# Altium schematic sheet POWER.SchDoc
size A4
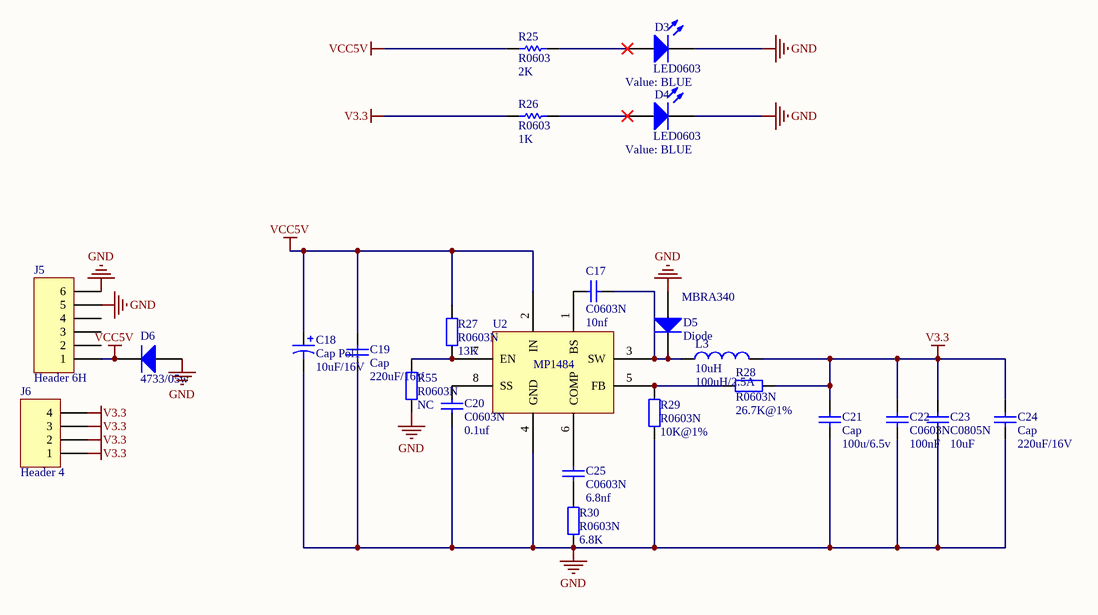
[diagram p0: POWER.SchDoc]

## Parts
C17  C0603N  value 10nf  [R0603N]
C18  Cap Pol1  value 10uF/16V  [C1206-A]
C19  Cap  value 220uF/16V  [16V220U-tie]
C20  C0603N  value 0.1uf  [R0603N]
C21  Cap  value 100u/6.5v  [C1210-A]
C22  C0603N  value 100nF  [R0603N]
C23  C0805N  value 10uF  [C0805]
C24  Cap  value 220uF/16V  [16V220U-tie]
C25  C0603N  value 6.8nf  [R0603N]
D3  LED0603  value BLUE  [LED0603]
D4  LED0603  value BLUE  [LED0603]
D5  Diode  value MBRA340  [403D_02]
D6  4733/05w  [ZMM5V1]
J5  Header 6H  [MINIcro-USB-G]
J6  Header 4  [HDR1X4]
L3  10uH  value 100uH/2.5A  [L10*10]
R25  R0603  value 2K  [R0603N]
R26  R0603  value 1K  [R0603N]
R27  R0603N  value 13K  [R0603N]
R28  R0603N  value 26.7K@1%  [R0603N]
R29  R0603N  value 10K@1%  [R0603N]
R30  R0603N  value 6.8K  [R0603N]
R55  R0603N  value NC  [R0603N]
U2  MP1484  [SO8_N]

## Nets
GND: C18.2 C19.2 C20.1 C21.2 C22.1 C23.1 C24.2 D3.2 D4.2 D5.1(A) D6.1 J5.5 J5.6 R29.1 R30.1 R55.1 U2.4(GND)
V3.3: C21.1 C22.2 C23.2 C24.1 J6.1 J6.2 J6.3 J6.4 L3.2 R26.1 R28.1
VCC5V: C18.1 C19.1 D6.2 J5.1 R25.1 R27.2 U2.2(IN)
NetC17_1: C17.1 U2.1(BS)
NetC17_2: C17.2 D5.2(K) L3.1 U2.3(SW)
NetC20_2: C20.2 U2.8(SS)
NetC25_1: C25.1 R30.2
NetC25_2: C25.2 U2.6(COMP)
NetD3_1: D3.1 R25.2
NetD4_1: D4.1 R26.2
NetR27_1: R27.1 R55.2 U2.7(EN)
NetR28_2: R28.2 R29.2 U2.5(FB)

Not connected (* = marked no-connect by the designer): J5 2 3 4

## Library data of the parts
C17 C19-C25 = Cap: Capacitor; Published: 8-Jun-2000; LatestRevisionDate: 17-Jul-2002; LatestRevisionNote: Re-released for DXP Platform.; PackageReference: RAD-0.3; Publisher: Altium Limited; PackageDescription: Radial Cap, Thru-Hole; 2 Leads; 0.3 in Pin Spacing
C18 = Cap Pol1: Polarized Capacitor (Radial); Published: 8-Jun-2000; LatestRevisionDate: 17-Jul-2002; LatestRevisionNote: Re-released for DXP Platform.; PackageReference: RB7.6-15; Publisher: Altium Limited
D3 D4 = LED
D5 = Diode: Default Diode; Published: 8-Jun-2000; LatestRevisionDate: 17-Jul-2002; LatestRevisionNote: Re-released for DXP Platform.; PackageVersion: Sep-1996; PackageReference: SMC; Publisher: Altium Limited; Code_JEDEC: DO-214-AB
D6 = Diode: Default Diode; VALUE: 4733
J5 = Header 6H: Header, 6-Pin, Right Angle; LatestRevisionDate: 17-Jul-2002; LatestRevisionNote: Re-released for DXP Platform.; Publisher: Altium Limited
J6 = Header 4: Header, 4-Pin; LatestRevisionDate: 17-Jul-2002; LatestRevisionNote: Re-released for DXP Platform.; Publisher: Altium Limited
L3 = Inductor: Code_IEC: 1005; Published: 8-Jun-2000; LatestRevisionDate: 29-May-2009; LatestRevisionNote: IPC-7351 Footprint Added.; PackageReference: 0402-A; Publisher: Altium Limited; PackageDescription: Chip Inductor; Code_JEITA: 0402
R25 R26 = Res Semi: Semiconductor Resistor
R27-R30 R55 = Res2: Resistor; Published: 8-Jun-2000; LatestRevisionDate: 17-Jul-2002; LatestRevisionNote: Re-released for DXP Platform.; PackageReference: AXIAL-0.4; Publisher: Altium Limited; PackageDescription: Axial Device, Thru-Hole; 2 Leads; 0.4 in Pin Spacing
U2 = Component_1